# EAGLE design lcd2usb (EAGLE 4.16)
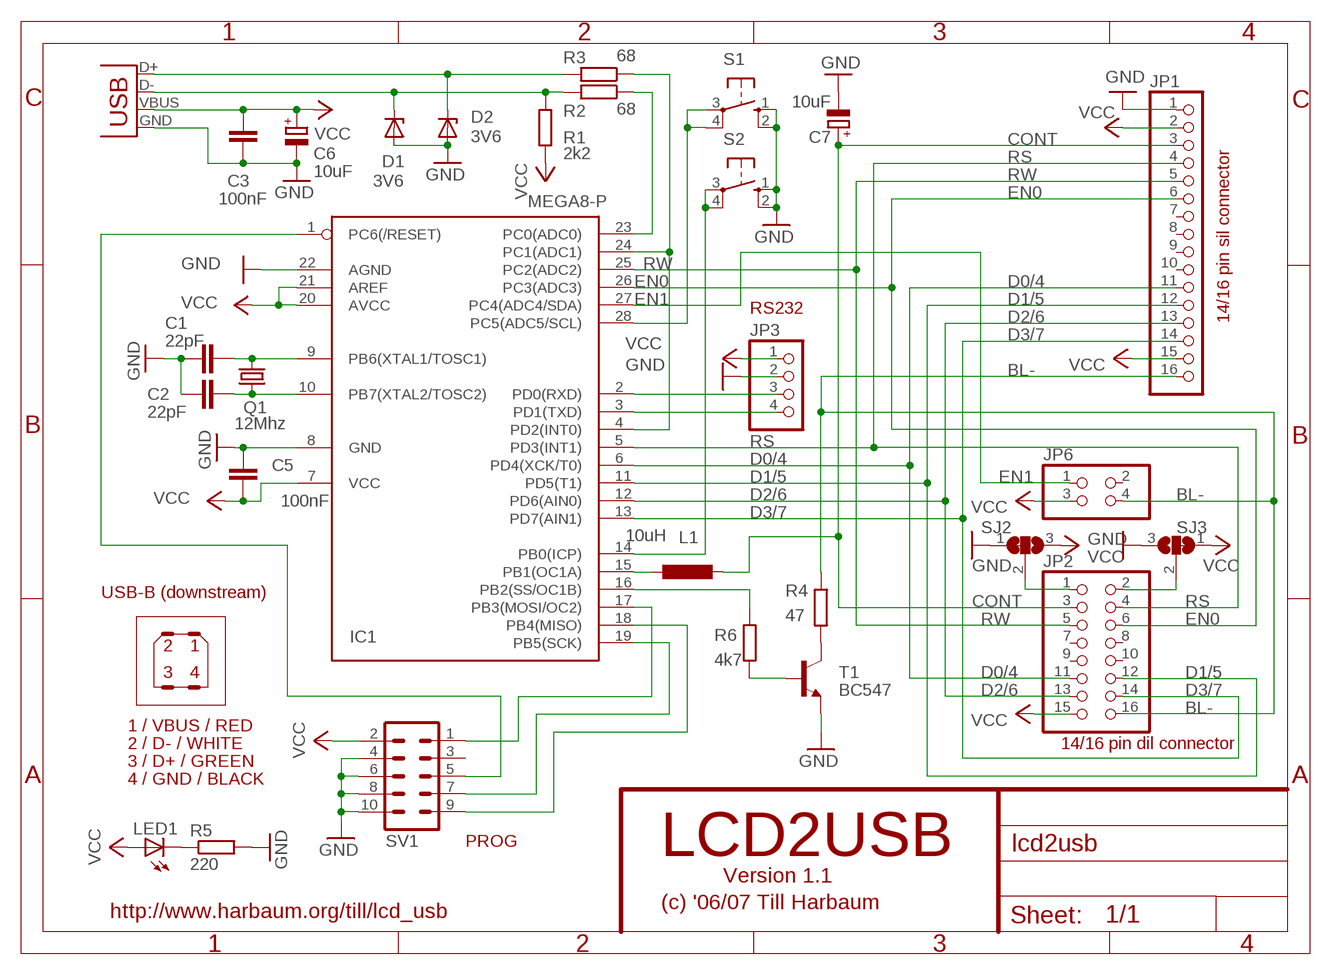
[diagram p0: schematic, sheet 1]

## Parts
C1  22pF  C-EU025-025X050  [C025-025X050]
C2  22pF  C-EU025-025X050  [C025-025X050]
C3  100nF  C-EU050-025X075  [C050-025X075]
C5  100nF  C-EU050-025X075  [C050-025X075]
C6  10uF  CPOL-EUTT2D5L  [TT2D5L]
C7  10uF  CPOL-EUTT2D5L  [TT2D5L]
D1  3V6  ZENER-DIODEDO35Z10  [DO35Z10]
D2  3V6  ZENER-DIODEDO35Z10  [DO35Z10]
IC1  MEGA8-P  [DIL28-3]
JP1  PINHD-1X16  [1X16]
JP2  PINHD-2X8  [2X08]
JP3  PINHD-1X4  [1X04]
JP6  PINHD-2X2  [2X02]
L1  10uH  L-EU0207/10  [0207/10]
LED1  LED3MM  [LED3MM]
Q1  12Mhz  CRYTALHC49S  [HC49/S]
R1  2k2  R-EU_0207/10  [0207/10]
R2  68  R-EU_0207/10  [0207/10]
R3  68  R-EU_0207/10  [0207/10]
R4  47  R-EU_0207/10  [0207/10]
R5  220  R-EU_0207/10  [0207/10]
R6  4k7  R-EU_0207/10  [0207/10]
S1  10-XX  [B3F-10XX]
S2  10-XX  [B3F-10XX]
SJ2  SJ2W  [SJ_2]
SJ3  SJ2W  [SJ_2]
SV1  ML10  [ML10]
T1  BC547  [TO92]
X1  USB-B-H  [USB-B-H]

## Nets
BL-: JP1.16 JP2.16 JP6.4 R4.1
CONT: C7.+ JP1.3 JP2.3 L1.2
D0/4: IC1.6(PD4(XCK/T0)) JP1.11 JP2.11
D1/5: IC1.11(PD5(T1)) JP1.12 JP2.12
D2/6: IC1.12(PD6(AIN0)) JP1.13 JP2.13
D3/7: IC1.13(PD7(AIN1)) JP1.14 JP2.14
EN0: IC1.26(PC3(ADC3)) JP1.6 JP2.6
EN1: IC1.27(PC4(ADC4/SDA)) JP6.1
GND: C1.1 C2.1 C3.2 C5.1 C6.- C7.- D1.A D2.A IC1.8(GND) IC1.22(AGND) JP1.1 JP3.2 R5.2 S1.1(S) S1.2(S1) S2.1(S) S2.2(S1) SJ2.1 SJ3.3 SV1.4 SV1.6 SV1.8 SV1.10 T1.1(E) X1.GND
N$1: C1.2 IC1.9(PB6(XTAL1/TOSC1)) Q1.2
N$2: C2.2 IC1.10(PB7(XTAL2/TOSC2)) Q1.1
N$4: R4.2 T1.3(C)
N$5: D1.C R1.1 R2.2 X1.D-
N$6: D2.C R3.2 X1.D+
N$7: IC1.15(PB1(OC1A)) L1.1
N$8: IC1.23(PC0(ADC0)) R2.1
N$9: IC1.4(PD2(INT0)) IC1.24(PC1(ADC1)) R3.1
N$10: IC1.17(PB3(MOSI/OC2)) SV1.1
N$11: IC1.1(PC6(/RESET)) SV1.5
N$12: IC1.19(PB5(SCK)) SV1.7
N$13: IC1.18(PB4(MISO)) SV1.9
N$14: IC1.3(PD1(TXD)) JP3.4
N$15: IC1.2(PD0(RXD)) JP3.3
N$16: LED1.K(C) R5.1
N$17: IC1.16(PB2(SS/OC1B)) R6.2
N$18: IC1.28(PC5(ADC5/SCL)) S1.3(P) S1.4(P1)
N$19: IC1.14(PB0(ICP)) S2.3(P) S2.4(P1)
N$20: JP2.2 SJ3.2
N$21: JP2.1 SJ2.2
N$22: R6.1 T1.2(B)
RS: IC1.5(PD3(INT1)) JP1.4 JP2.4
RW: IC1.25(PC2(ADC2)) JP1.5 JP2.5
VCC: C3.1 C5.2 C6.+ IC1.7(VCC) IC1.20(AVCC) IC1.21(AREF) JP1.2 JP1.15 JP2.15 JP3.1 JP6.3 LED1.A R1.2 SJ2.3 SJ3.1 SV1.2 X1.VBUS
Unconnected: JP1.7 JP1.8 JP1.9 JP1.10 JP2.7 JP2.8 JP2.9 JP2.10 JP6.2 SV1.3

## Notes on the sheet
- RS232
- 14/16 pin sil connector
- USB-B (downstream)
- 2 | 1
- 3 | 4
- 1 / VBUS / RED
- 2 / D- / WHITE | 14/16 pin dil connector
- 3 / D+ / GREEN
- 4 / GND / BLACK
- PROG
- LCD2USB
- Version 1.1
- (c) '06/07 Till Harbaum
- http://www.harbaum.org/till/lcd_usb

## Library data of the parts
C1-C3 C5 = rcl:C-EU: CAPACITOR, European symbol
C6 C7 = rcl:CPOL-EU: POLARIZED CAPACITOR, European symbol
D1 D2 = diode:ZENER-DIODE: Z-Diode
IC1 = avr:MEGA8-P: MICROCONTROLLER 8 Kbytes FLASH 1 kbytes SRAM 512 bytes EEPROM USART 4-channel 10 bit ADC 2-channel 8 bit ADC
JP1 = pinhead:PINHD-1X16: PIN HEADER
JP2 = pinhead:PINHD-2X8: PIN HEADER
JP3 = pinhead:PINHD-1X4: PIN HEADER
JP6 = pinhead:PINHD-2X2: PIN HEADER
L1 = rcl:L-EU: INDUCTOR, European symbol
LED1 = led:LED: LED OSRAM: - CHIPLED LG R971, LG N971, LY N971, LG Q971, LY Q971, LO R971, LY R971 LH N974, LH R974 LS Q976, LO Q976, LY Q976 LO Q996 - Hyper CHIPLED LW Q18S LB Q993, LB Q99A, LB R99A - SideLED LS A670, LO A670, LY A670, LG A670, LP A670 LB A673, LV A673, LT A673, LW A673 LH A674 LY A675 LS A676, LA A676, LO A676, LY A676, LW A676 LS A679, LY A679, LG A679 - Hyper Micro SIDELED® LS Y876, LA Y876, LO Y876, LY Y876 LT Y87S - SmartLED LW L88C, LW L88S LB L89C, LB L89S, LG L890 LS L89K, LO L89K, LY L89K LS L896, LA L896, LO L896, LY L896 - TOPLED LS T670, LO T670, LY T670, LG T670, LP T670 LSG T670, LSP T670, LSY T670, LOP T670, LYG T670 LG T671, LOG T671, LSG T671 LB T673, LV T673, LT T673, LW T673 LH T674 LS T676, LA T676, LO T676, LY T676, LB T676, LH T676, LSB T676, LW T676 LB T67C, LV T67C, LT T67C, LS T67K, LO T67K, LY T67K, LW E67C LS E67B, LA E67B, LO E67B, LY E67B, LB E67C, LV E67C, LT E67C LW T67C LS T679, LY T679, LG T679 LS T770, LO T770, LY T770, LG T770, LP T770 LB T773, LV T773, LT T773, LW T773 LH T774 LS E675, LA E675, LY E675, LS T675 LS T776, LA T776, LO T776, LY T776, LB T776 LHGB T686 LT T68C, LB T68C - Hyper Mini TOPLED® LB M676 - Mini TOPLED Santana® LG M470 LS M47K, LO M47K, LY M47K Source: http://www.osram.convergy.de/
Q1 = crystal:CRYTAL: CRYSTAL
R1-R6 = rcl:R-EU_: RESISTOR, European symbol
S1 S2 = switch-omron:10-XX: OMRON SWITCH
SJ2 SJ3 = jumper:SJ2W: SMD solder JUMPER
SV1 = con-ml:ML10: HARTING
T1 = transistor:BC547: NPN TRANSISTOR
X1 = con-usb:USB: USB Connectors

## Board
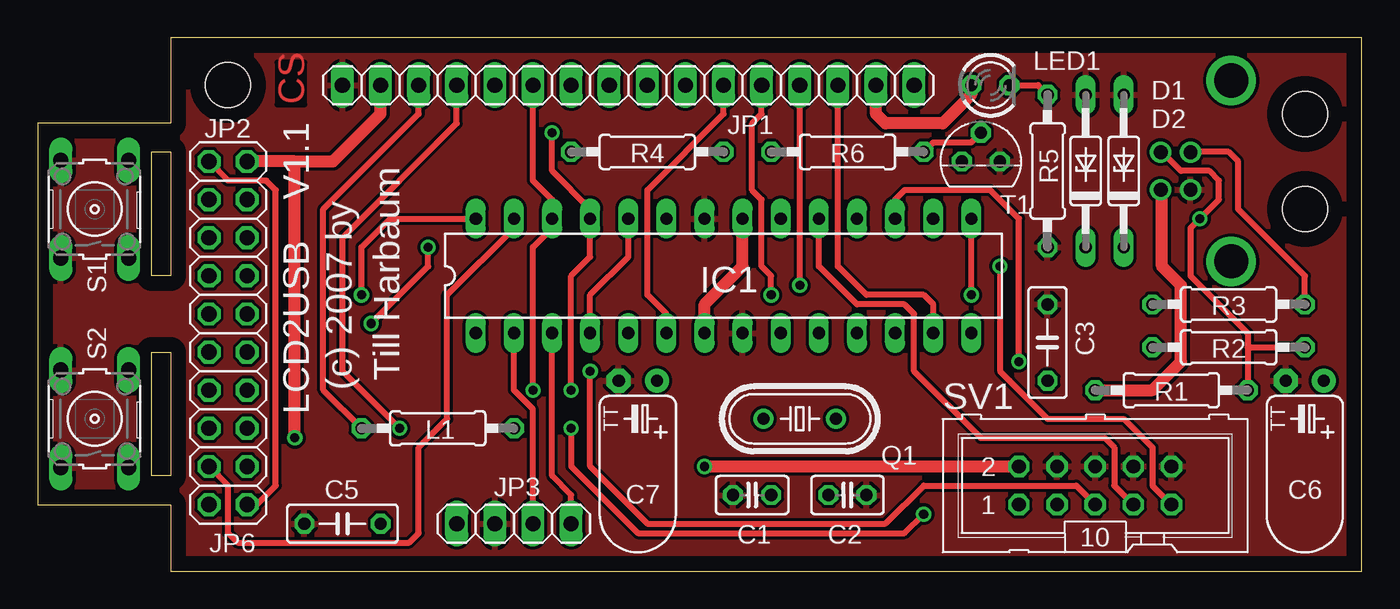
[diagram p1: board, top side]
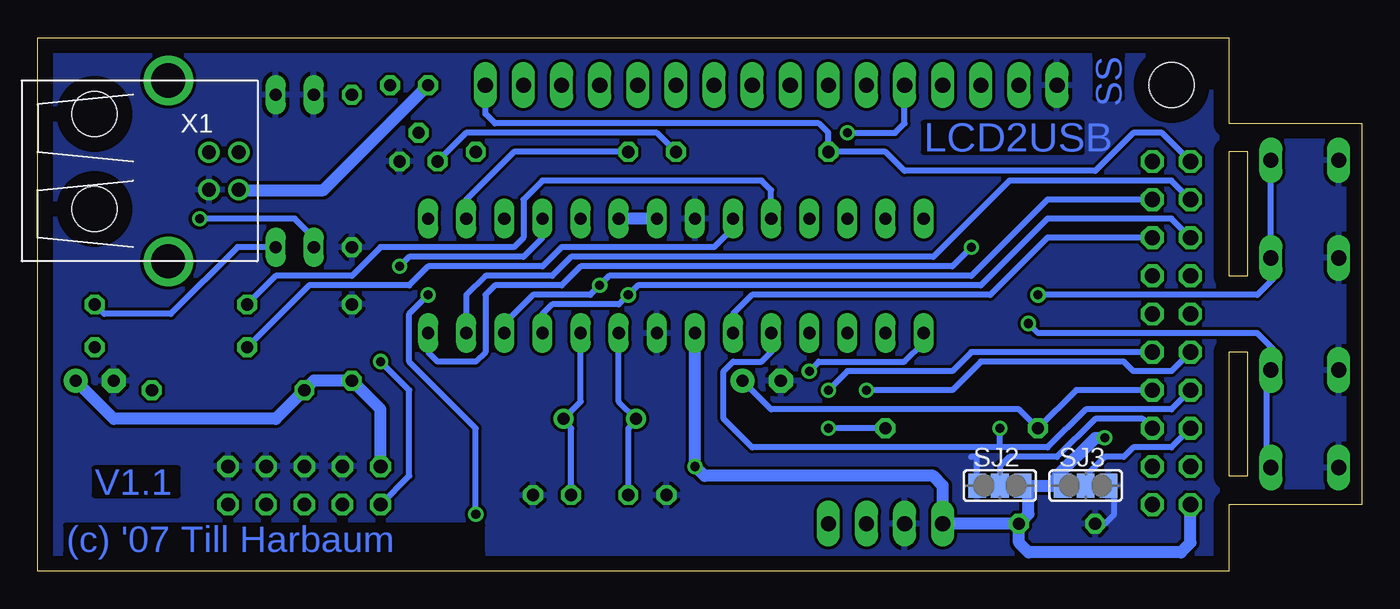
[diagram p2: board, bottom side, seen from below]

Size 88.27 x 35.56 mm. Coordinates in mm from the lower left corner, seen from the top.
Outline: 0,4.45 8.89,4.45 8.89,0 88.27,0 88.27,35.56 8.89,35.56 8.89,29.84 0,29.84 0,4.45
Outline: 7.62,27.94 8.89,27.94 8.89,19.68 7.62,19.68 7.62,27.94
Outline: 7.62,6.35 7.62,14.61 8.89,14.61 8.89,6.35 7.62,6.35
Copper layers (1*16): Top 0.035mm / dielectric 1.5mm / Bottom 0.035mm
Design rules "default": minimum track width 10mil, minimum drill 24mil, track to track 8mil, track to pad 8mil, pad to pad 8mil, via to via 8mil, smd to smd 8mil, copper to edge 40mil, drill to drill 8mil, minimum pad ring 10mil, minimum via ring 8mil, stop-mask expansion 4mil, vias tented up to drill 0mil, thermal gap 10mil
Holes 3 mm at 12.7,32.38 84.45,30.48 84.45,24.13

### Footprints (pad centres in the part's own frame; a part is rotated, then mirrored left to right if it is on the bottom)
C025-025X050 = drill 0.813 octagon: 1 -1.27,0; 2 1.27,0
C050-025X075 = drill 0.813 octagon: 1 -2.54,0; 2 2.54,0
TT2D5L = drill 0.813 pad 1.6 round: + -1.27,0 | drill 0.813 pad 1.6 octagon: - 1.27,0
DO35Z10 = drill 0.813 long: A 5.08,0; C -5.08,0
DIL28-3 = drill 0.813 long: 1 -16.51,-3.81; 2 -13.97,-3.81; 3 -11.43,-3.81; 4 -8.89,-3.81; 5 -6.35,-3.81; 6 -3.81,-3.81; 7 -1.27,-3.81; 8 1.27,-3.81; 9 3.81,-3.81; 10 6.35,-3.81; 11 8.89,-3.81; 12 11.43,-3.81; 13 13.97,-3.81; 14 16.51,-3.81; 15 16.51,3.81; 16 13.97,3.81; 17 11.43,3.81; 18 8.89,3.81; 19 6.35,3.81; 20 3.81,3.81; 21 1.27,3.81; 22 -1.27,3.81; 23 -3.81,3.81; 24 -6.35,3.81; 25 -8.89,3.81; 26 -11.43,3.81; 27 -13.97,3.81; 28 -16.51,3.81
1X16 = drill 1.016 long: 1 -19.05,0; 2 -16.51,0; 3 -13.97,0; 4 -11.43,0; 5 -8.89,0; 6 -6.35,0; 7 -3.81,0; 8 -1.27,0; 9 1.27,0; 10 3.81,0; 11 6.35,0; 12 8.89,0; 13 11.43,0; 14 13.97,0; 15 16.51,0; 16 19.05,0
2X08 = drill 1.016 octagon: 1 -8.89,-1.27; 2 -8.89,1.27; 3 -6.35,-1.27; 4 -6.35,1.27; 5 -3.81,-1.27; 6 -3.81,1.27; 7 -1.27,-1.27; 8 -1.27,1.27; 9 1.27,-1.27; 10 1.27,1.27; 11 3.81,-1.27; 12 3.81,1.27; 13 6.35,-1.27; 14 6.35,1.27; 15 8.89,-1.27; 16 8.89,1.27
1X04 = drill 1.016 long: 1 -3.81,0; 2 -1.27,0; 3 1.27,0; 4 3.81,0
2X02 = drill 1.016 octagon: 1 -1.27,-1.27; 2 -1.27,1.27; 3 1.27,-1.27; 4 1.27,1.27
0207/10 = drill 0.813 octagon: 1 -5.08,0; 2 5.08,0
LED3MM = drill 0.813 octagon: A -1.27,0; K 1.27,0
HC49/S = drill 0.813 round: 1 -2.413,0; 2 2.413,0
B3F-10XX = drill 1.016 long: 1 -3.251,2.261; 2 3.251,2.261; 3 -3.251,-2.261; 4 3.251,-2.261
SJ_2 = smd 1.168 x 1.6: 1 -1.524,0; 2 0,0; 3 1.524,0
ML10 = drill 0.914 octagon: 1 -5.08,-1.27; 2 -5.08,1.27; 3 -2.54,-1.27; 4 -2.54,1.27; 5 0,-1.27; 6 0,1.27; 7 2.54,-1.27; 8 2.54,1.27; 9 5.08,-1.27; 10 5.08,1.27
TO92 = drill 0.813 octagon: 1 1.27,0; 2 0,1.905; 3 -1.27,0
USB-B-H = drill 0.914 round: D+ 0,1.25; D- 1.981,1.25; GND 0,-1.25; VBUS 1.981,-1.25 | drill 2.286 round: P$1 -2.718,-6.02; P$2 -2.718,6.02

### Placement (x,y rotation side)
C1  47.62,5.08 0 top
C2  53.98,5.08 180 top
C3  67.31,15.24 90 top
C5  20.32,3.17 0 top
C6  84.45,12.7 180 top
C7  40.01,12.7 180 top
D1  69.85,26.67 90 top
D2  72.39,26.67 90 top
IC1  45.72,19.68 0 top
JP1  39.37,32.38 0 top
JP2  12.7,18.41 90 top
JP3  31.75,3.17 0 top
JP6  12.7,5.71 270 top
L1  26.67,9.53 180 top
LED1  63.5,32.38 0 top
Q1  50.8,10.16 180 top
R1  75.56,12.06 180 top
R2  79.38,14.92 0 top
R3  79.38,17.78 0 top
R4  40.64,27.94 0 top
R5  67.31,26.67 270 top
R6  53.98,27.94 180 top
S1  3.81,24.13 90 top
S2  3.81,10.16 90 top
SJ2  24.13,5.71 0 bottom
SJ3  18.41,5.71 0 bottom
SV1  70.48,5.71 0 top
T1  62.87,27.3 0 top
X1  76.83,26.67 0 bottom

### Tracks (layer width: path | path; a pad name or v marks a point on that pad's centre or on a via)
BL-
  Top 0.406: JP6.4 14.61,4.45 15.88,5.71 15.88,25.4 15.24,26.04 12.7,26.04 JP2.16
  Bottom 0.406: JP2.16 13.34,29.21 15.24,29.21 17.78,26.67 30.48,26.67 31.75,27.94 R4.1 35.56,29.21 36.2,29.84 57.78,29.84 58.42,30.48 JP1.16
CONT
  Top 0.406: JP1.3 25.4,30.48 19.05,24.13 19.05,12.06 L1.2
  Bottom 0.406: C7.+ 39.37,10.79 22.86,10.79 L1.2 19.05,12.06 JP2.3
D0/4
  Top 0.406: JP1.11 45.72,30.48 40.64,25.4 40.64,18.41 41.91,17.14 IC1.6
  Bottom 0.406: IC1.6 41.91,17.14 40.64,18.41 24.77,18.41 20.95,22.23 JP2.11
D1/5  (via drill 0.61)
  Top 0.406: JP1.12 48.26,30.48 47.62,29.84 47.62,25.4 48.26,24.77 48.26,20.32 48.9,19.68 v48.9,18.41
  Bottom 0.406: 48.26,19.05 25.4,19.05 20.95,23.5 12.7,23.5 JP2.12 | 48.26,19.05 49.53,17.78 53.98,17.78 54.61,17.14 IC1.11 | 48.26,19.05 v48.9,18.41
D2/6  (via drill 0.61)
  Top 0.406: v50.8,19.05 JP1.13
  Bottom 0.406: 51.44,18.41 50.16,19.68 26.04,19.68 20.95,24.77 JP2.13 | 51.44,18.41 55.24,18.41 57.15,16.51 IC1.12 | 51.44,18.41 v50.8,19.05
D3/7
  Top 0.406: IC1.13 59.69,17.78 59.05,18.41 55.24,18.41 53.34,20.32 JP1.14
  Bottom 0.406: IC1.13 59.69,18.41 58.42,19.68 53.98,19.68 52.7,20.95 28.57,20.95 23.5,26.04 12.7,26.04 JP2.14
EN0  (via drill 0.61)
  Top 0.406: v33.02,12.06 33.02,21.59 34.29,22.86 IC1.26 34.29,24.77 33.02,26.04 JP1.6
  Bottom 0.406: v33.02,12.06 27.3,12.06 25.4,13.97 15.88,13.97 15.24,13.34 12.7,13.34 JP2.6
EN1
  Top 0.406: IC1.27 31.75,22.86 27.3,18.41 27.3,10.16 25.4,8.26 25.4,2.54 24.77,1.91 13.34,1.91 12.7,2.54 12.7,5.71 JP6.1
GND
  Bottom 0.406: SJ2.1 25.65,7.62 26.04,7.62 | C5.1 17.14,3.17 16.51,3.81 16.51,5.71 SJ3.3
  pour Bottom: 88.27,0 8.89,0 8.89,4.45 0,4.45 0,29.84 8.89,29.84 8.89,35.56 88.27,35.56
  pour Top: 0,4.45 0,29.84 8.89,29.84 8.89,35.56 88.27,35.56 88.27,0 8.89,0 8.89,4.45
N$1
  Bottom 0.406: IC1.9 49.53,11.3 Q1.2 48.26,10.16 48.9,9.53 C1.2
N$2
  Bottom 0.406: IC1.10 52.07,11.3 Q1.1 53.34,10.16 52.7,9.53 C2.2
N$4
  Bottom 0.406: R4.2 46.99,29.21 59.69,29.21 T1.3
N$5  (via drill 0.6)
  Top 0.406: X1.D- 74.91,27.92 74.93,27.94 76.2,26.67 78.11,26.67 78.74,26.04 78.74,24.77 v77.47,23.5 76.83,22.86 76.83,19.68 80.64,15.88 80.64,14.92 | 80.64,14.92 R1.1 | 80.64,14.92 R2.2
  Bottom 0.406: D1.C 69.85,22.23 71.12,23.5 v77.47,23.5
N$6
  Top 0.406: R3.2 84.45,19.68 80.01,24.13 80.01,27.3 79.38,27.94 76.83,27.94 X1.D+
  Bottom 0.406: D2.C 74.93,21.59 79.38,17.14 83.82,17.14 R3.2
N$7  (via drill 0.61)
  Top 0.406: v35.56,9.53 35.56,6.99 40.01,2.54 57.78,2.54 v59.05,3.81 | v62.23,18.41 IC1.15
  Bottom 0.406: L1.1 v35.56,9.53 | v59.05,3.81 59.05,9.53 63.5,13.97 63.5,17.14 v62.23,18.41
N$8
  Bottom 0.406: IC1.23 41.91,22.86 43.18,21.59 53.34,21.59 54.61,20.32 62.23,20.32 63.5,19.05 70.17,19.05 R2.1
N$9
  Top 0.406: IC1.4 36.83,18.41 39.37,20.95 IC1.24
  Bottom 0.406: IC1.24 39.37,25.4 40.01,26.04 54.61,26.04 55.88,24.77 55.88,22.23 56.52,21.59 65.41,21.59 67.31,19.68 72.39,19.68 R3.1
N$10  (via drill 0.61)
  Top 0.406: IC1.17 57.15,24.77 57.78,25.4 63.5,25.4 65.41,23.5 v65.41,13.97
  Bottom 0.406: v65.41,13.97 63.5,12.06 63.5,6.35 SV1.1
N$11  (via drill 0.61)
  Top 0.406: v36.83,13.34 36.83,6.99 40.64,3.17 56.52,3.17 59.05,5.71 69.22,5.71 SV1.5
  Bottom 0.406: IC1.1 29.21,15.24 30.48,13.97 36.2,13.97 v36.83,13.34
N$12
  Top 0.406: IC1.19 52.07,20.32 54.61,17.78 57.78,17.78 58.42,17.14 58.42,13.34 62.87,8.89 71.12,8.89 71.75,8.26 71.75,5.71 SV1.7
N$13  (via drill 0.61)
  Top 0.406: v64.14,20.32 64.14,13.34 64.77,12.7 67.31,10.16 72.39,10.16 74.3,8.26 74.3,5.71 SV1.9
  Bottom 0.406: IC1.18 54.61,22.23 55.88,20.95 63.5,20.95 v64.14,20.32
N$14
  Top 0.406: JP3.4 35.56,5.08 34.29,6.35 IC1.3
N$15
  Top 0.406: JP3.3 33.02,10.79 31.75,12.06 IC1.2
N$16
  Top 0.406: LED1.K 66.67,32.38 R5.1
N$17
  Bottom 0.406: IC1.16 59.69,24.77 56.52,27.94 R6.2
N$18  (via drill 0.61)
  Top 0.406: IC1.28 23.5,23.5 21.59,21.59 v21.59,18.41
  Bottom 0.406: 5.79,20.88 5.71,20.95 6.07,21.31 S1.4 | 5.79,20.88 S1.3 | v21.59,18.41 6.99,18.41 5.71,19.68 5.79,20.88
N$19  (via drill 0.61)
  Top 0.406: v26.04,21.59 26.04,20.32 v22.23,16.51
  Bottom 0.406: IC1.14 62.23,14.61 61.59,13.97 59.05,13.97 58.42,14.61 58.42,18.41 57.78,19.05 53.34,19.05 52.07,20.32 27.3,20.32 v26.04,21.59 | v22.23,16.51 21.59,15.88 6.99,15.88 5.71,14.61 5.71,13.34 5.99,13.34 S2.4 6.15,13.34 6.35,13.34 6.35,7.19 S2.3
N$20
  Bottom 0.406: JP2.2 12.7,8.26 15.24,8.26 15.88,7.62 17.14,7.62 18.41,6.35 SJ3.2 20.32,5.71
N$21
  Bottom 0.406: JP2.1 14.61,10.16 17.78,10.16 20.32,7.62 23.5,7.62 24.13,6.99 SJ2.2 26.04,5.71
N$22
  Top 0.406: R6.1 59.69,28.57 62.23,28.57 T1.2
RS  (via drill 0.61)
  Top 0.406: v24.13,9.53 20.32,13.34 20.32,22.23 27.94,29.84 JP1.4
  Bottom 0.406: IC1.5 39.37,14.61 40.01,13.97 41.91,13.97 42.55,13.34 42.55,10.16 40.64,8.26 24.13,8.26 | JP2.4 12.7,10.79 18.41,10.79 20.95,8.26 24.13,8.26 | 24.13,8.26 v24.13,9.53
RW  (via drill 0.61)
  Top 0.406: v35.56,12.06 35.56,19.68 36.83,20.95 IC1.25 36.83,24.13 34.29,26.67 v34.29,29.21
  Bottom 0.406: v34.29,29.21 31.11,29.21 30.48,29.84 JP1.5 | v35.56,12.06 34.29,13.34 27.3,13.34 26.04,14.61 JP2.5
VCC  (via drill 0.61)
  Top 0.813: v17.14,8.89 17.14,27.3 | 17.14,27.3 19.68,27.3 22.86,30.48 JP1.2 | IC1.7 44.45,17.78 46.99,20.32 IC1.21 | v44.45,6.99 SV1.2 | 17.14,27.3 JP2.15 | JP1.15 55.88,30.48 56.52,29.84 60.33,29.84 62.23,31.75 LED1.A | R1.2 74.3,12.06 76.2,13.97 76.2,19.05 74.93,20.32 74.93,25.4 74.87,25.4 X1.VBUS
  Bottom 0.406: 20.32,5.71 SJ3.1 | 22.23,5.71 SJ2.3
  Bottom 0.813: C5.2 JP3.1 27.94,5.71 28.57,6.35 43.81,6.35 v44.45,6.99 IC1.7 | IC1.21 IC1.20 | SV1.2 65.41,10.79 C3.1 69.85,12.7 R1.2 72.39,10.16 83.19,10.16 C6.+ | LED1.A 69.22,25.4 74.93,25.4 74.91,25.42 X1.VBUS | v17.14,8.89 17.78,8.89 20.32,6.35 20.32,5.71 22.23,5.71 22.23,3.81 C5.2 | JP6.3 11.43,1.91 12.06,1.27 22.23,1.27 22.86,1.91 C5.2

### Text on the board
Top: CS
Bottom: SS | LCD2USB | V1.1 | (c) '07 Till Harbaum
tNames: V1.1 | Till Harbaum | (c) 2007 by | LCD2USB